# Altium schematic sheet Wheel.SchDoc
size A4
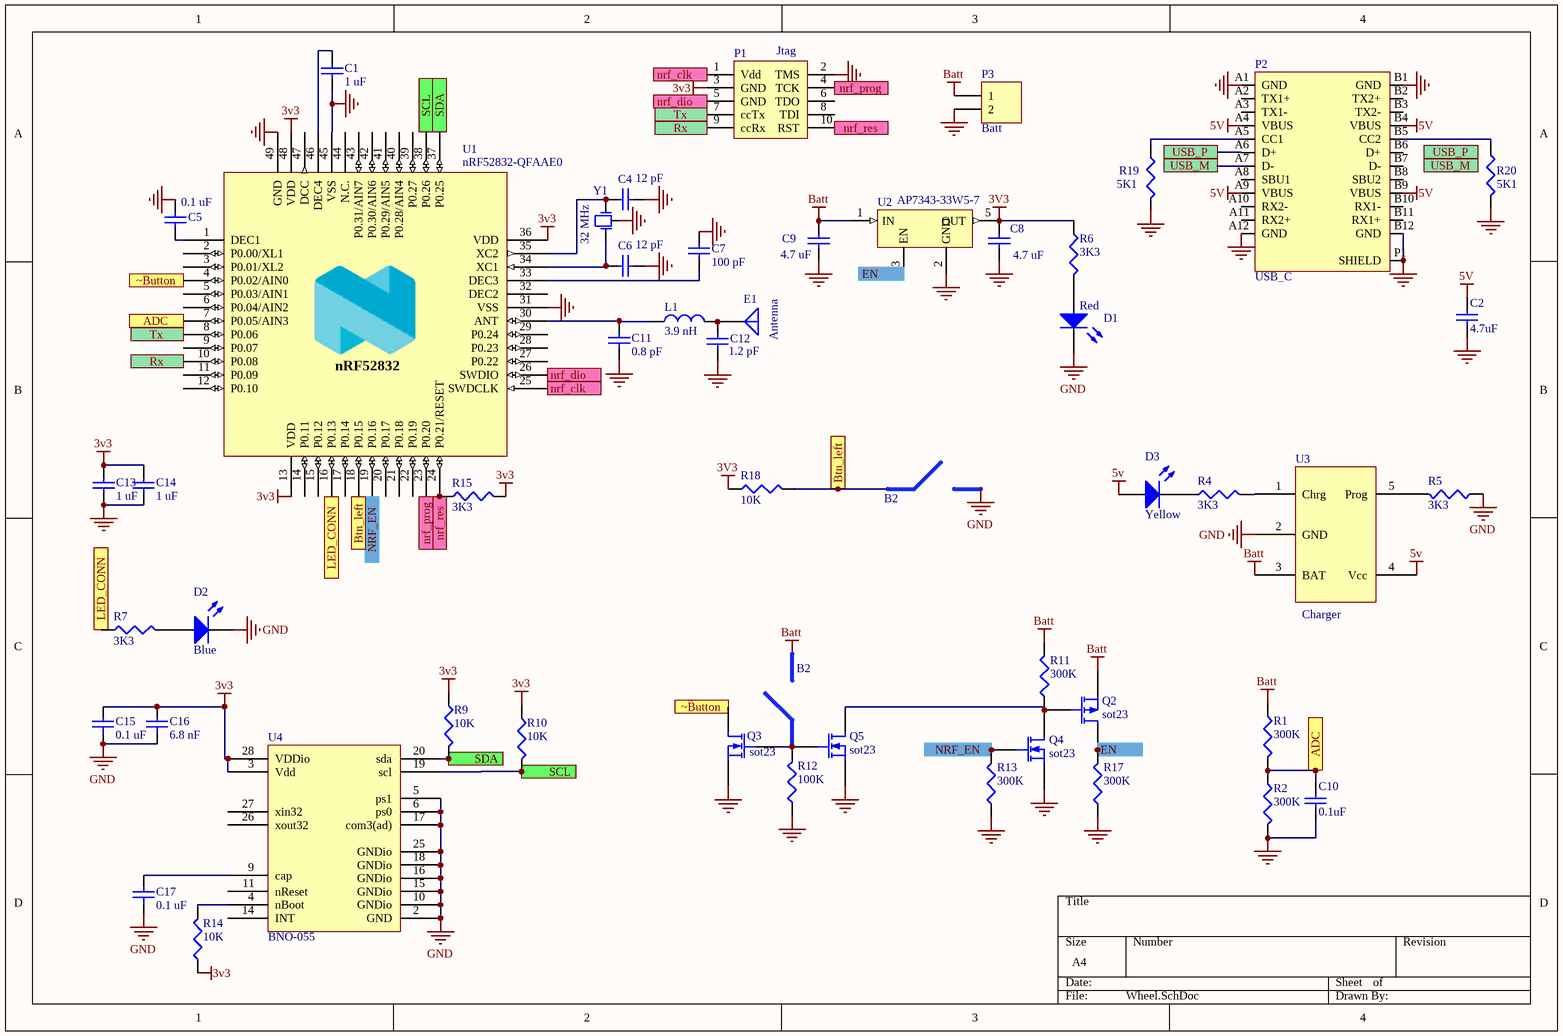
[diagram p0: Wheel.SchDoc]

## Parts
(Parts that share a designator on the sheet are numbered #1, #2 ... from top to bottom, then left to right.)
B2#1  LEFT  [Button_thin]  (value not drawn)
B2#2  RIGHT  [Button_thin]  (value not drawn)
C1  value 1 uF  [cap_0603]  (hidden comment: ceram)
C2  value 4.7uF  [cap_0603]  (hidden comment: ceram)
C4  value 12 pF  [cap_0603]  (hidden comment: ceram)
C5  value 0.1 uF  [cap_0603]  (hidden comment: ceram)
C6  value 12 pF  [cap_0603]  (hidden comment: ceram)
C7  value 100 pF  [cap_0603]  (hidden comment: ceram)
C8  value 4.7 uF  [cap_0603]  (hidden comment: ceram)
C9  value 4.7 uF  [cap_0603]  (hidden comment: ceram)
C10  value 0.1uF  [cap_0603]  (hidden comment: ceram)
C11  value 0.8 pF  [cap_0603]  (hidden comment: ceram)
C12  value 1.2 pF  [cap_0603]  (hidden comment: ceram)
C13  value 1 uF  [cap_0603]  (hidden comment: ceram)
C14  value 1 uF  [cap_0603]  (hidden comment: ceram)
C15  value 0.1 uF  [cap_0603]  (hidden comment: ceram)
C16  value 6.8 nF  [cap_0603]  (hidden comment: ceram)
C17  value 0.1 uF  [cap_0603]  (hidden comment: ceram)
D1  value Red  [led_0603]  (hidden comment: led_0603)
D2  Blue  [led_0603]
D3  Yellow  [led_0603]
E1  Antenna  [WBx5_ANT]
L1  value 3.9 nH  [IND SMD 0603]  (hidden comment: Ind)
P1  Jtag  [FTSH-105-01-F-DV-K]
P2  USB_C  [USB_C_FULL]
P3  Batt  [HDR1X2]
Q2  sot23  [sot23]
Q3  sot23  [sot23]
Q4  sot23  [sot23]
Q5  sot23  [sot23]
R1  value 300K  [res_0603]  (hidden comment: Res3)
R2  value 300K  [res_0603]  (hidden comment: Res3)
R4  value 3K3  [res_0603]  (hidden comment: res_0603)
R5  value 3K3  [res_0603]  (hidden comment: res_0603)
R6  value 3K3  [res_0603]  (hidden comment: res_0603)
R7  value 3K3  [res_0603]  (hidden comment: res_0603)
R9  value 10K  [res_0603]  (hidden comment: res_0603)
R10  value 10K  [res_0603]  (hidden comment: res_0603)
R11  value 300K  [res_0603]  (hidden comment: Res3)
R12  value 100K  [res_0603]  (hidden comment: Res3)
R13  value 300K  [res_0603]  (hidden comment: Res3)
R14  value 10K  [res_0603]  (hidden comment: res_0603)
R15  value 3K3  [res_0603]  (hidden comment: res_0603)
R17  value 300K  [res_0603]  (hidden comment: Res3)
R18  value 10K  [res_0603]  (hidden comment: res_0603)
R19  value 5K1  [res_0603]  (hidden comment: res_0603)
R20  value 5K1  [res_0603]  (hidden comment: res_0603)
U1  nRF52832-QFAAE0  [QFN48N]
U2  AP7343-33W5-7  [sot23-5]
U3  Charger  [sot23-5]
U4  BNO-055  [LGA-28]
Y1  value 32 MHz  [TSX-3225]  (hidden comment: Crystal Oscillator)

## Ports
ADC, Btn_left, EN, LED_CONN, nrf_clk, nrf_dio, NRF_EN, nrf_prog, nrf_res, Rx, SCL, SDA, Tx, USB_M, USB_P, ~Button

## Nets
3v3: C8.2 C13.2 C14.2 C15.2 C16.2 P1.3(GND) R6.1 R9.1 R10.1 R14.1 R15.2 R18.1 U1.13(VDD) U1.36(VDD) U1.48(VDD) U2.5(OUT) U4.3(Vdd) U4.28(VDDio)
5V: C2.1 D3.2(A) P2.A4(VBUS) P2.A9(VBUS) P2.B4(VBUS) P2.B9(VBUS) U3.4(Vcc)
Batt: B2#2.2 C9.2 P3.1 Q2.2(S) R1.1 R11.1 U2.1(IN) U3.3(BAT)
GND: B2#1.2 C1.1 C2.2 C4.2 C5.2 C6.2 C7.1 C8.1 C9.1 C10.2 C11.2 C12.2 C13.1 C14.1 C15.1 C16.1 C17.1 D1.1(K) D2.1(K) P1.2(TMS) P2.A1(GND) P2.A12(GND) P2.B1(GND) P2.B12(GND) P2.P1(SHIELD) P3.2 Q3.2(S) Q4.2(S) Q5.2(S) R2.2 R5.1 R12.1 R13.2 R17.2 R19.2 R20.2 U1.31(VSS) U1.45(VSS) U1.49(GND) U2.2(GND) U3.2(GND) U4.2(GND) U4.5(ps1) U4.6(ps0) U4.10(GNDio) U4.15(GNDio) U4.16(GNDio) U4.17(com3(ad)) U4.18(GNDio) U4.25(GNDio) Y1.3(OSC1)
ADC: C10.1 R1.2 R2.1 U1.7(P0.05/AIN3) ; port ADC
Btn_left: B2#1.1 R18.2 U1.18(P0.15) ; port Btn_left
EN: Q2.3(D) R17.1 U2.3(EN) ; port EN
LED_CONN: R7.1 U1.16(P0.13) ; port LED_CONN
nrf_clk: P1.1(Vdd) U1.25(SWDCLK) ; port nrf_clk
nrf_dio: P1.5(GND) U1.26(SWDIO) ; port nrf_dio
NRF_EN: Q4.1(G) R13.1 U1.19(P0.16) ; port NRF_EN
nrf_prog: P1.4(TCK) U1.23(P0.20) ; port nrf_prog
nrf_res: P1.10(RST) R15.1 U1.24(P0.21/RESET) ; port nrf_res
Rx: P1.9(ccRx) U1.10(P0.08) ; port Rx
SCL: R10.2 U1.38(P0.26) U4.19(scl) ; port SCL
SDA: R9.2 U1.37(P0.25) U4.20(sda) ; port SDA
Tx: P1.7(ccTx) U1.8(P0.06) ; port Tx
USB_M: P2.A7(D-) ; port USB_M
USB_P: P2.A6(D+) ; port USB_P
~Button: Q3.3(D) U1.4(P0.02/AIN0) ; port ~Button
NetB2#2_1: B2#2.1 Q3.1(G) Q5.1(G) R12.2
NetC1_2: C1.2 U1.46(DEC4)
NetC4_1: C4.1 U1.35(XC2) Y1.2(OSC2)
NetC5_1: C5.1 U1.1(DEC1)
NetC6_1: C6.1 U1.34(XC1) Y1.1(OSC1)
NetC7_2: C7.2 U1.33(DEC3)
NetC11_1: C11.1 L1.1 U1.30(ANT)
NetC12_1: C12.1 E1.1(A) L1.2
NetC17_2: C17.2 U4.9(cap)
NetD1_2: D1.2(A) R6.2
NetD2_2: D2.2(A) R7.2
NetD3_1: D3.1(K) R4.1
NetP2_A5: P2.A5(CC1) R19.1
NetP2_B5: P2.B5(CC2) R20.1
NetQ2_1: Q2.1(G) Q4.3(D) Q5.3(D) R11.2
NetR4_2: R4.2 U3.1(Chrg)
NetR5_2: R5.2 U3.5(Prog)
NetR14_2: R14.2 U4.4(nBoot)

Not connected (* = marked no-connect by the designer): P1 6(TDO) 8(TDI); P2 A2(TX1+) A3(TX1-) A8(SBU1) A10(RX2-) A11(RX2+) B2(TX2+) B3(TX2-) B6(D+) B7(D-) B8(SBU2) B10(RX1-) B11(RX1+); U1 2(P0.00/XL1) 3(P0.01/XL2) 5(P0.03/AIN1) 6(P0.04/AIN2) 9(P0.07) 11(P0.09) 12(P0.10) 14(P0.11) 15(P0.12) 17(P0.14) 20(P0.17) 21(P0.18) 22(P0.19) 27(P0.22) 28(P0.23) 29(P0.24) 32(DEC2) 39(P0.27) 40(P0.28/AIN4) 41(P0.29/AIN5) 42(P0.30/AIN6) 43(P0.31/AIN7) 44(N.C.) 47(DCC); U4 11(nReset) 14(INT) 26(xout32) 27(xin32)

## Notes on the sheet
- (in symbol nRF52832_QFAA) nRF52832

## Library data of the parts
B2#1 B2#2 = tact button: FSM6JH
C1 C2 C4-C17 = cap_0603
D1-D3 = led_0603: led
E1 = Antenna: Generic Antenna; Published: 24-Mar-1999; LatestRevisionDate: 17-Jul-2002; LatestRevisionNote: Re-released for DXP Platform.; PackageReference: PIN1; Publisher: Altium Limited
L1 = Ind. SMD: Inductance
P1 = cc1310 jtag header: FTSH-105-01-F-DV-K; Part: FTSH-105-01-F-DV-K; Part2: PLLD1.27-10S
P2 = USB_C_FULL: Part: 1054500101
P3 = Header 2: Header, 2-Pin; LatestRevisionDate: 17-Jul-2002; LatestRevisionNote: Re-released for DXP Platform.; Publisher: Altium Limited
Q2 = P_ch sot23: Part: IRLML2244TRPBF
Q3-Q5 = N_ch sot23: Part: IRLML2402TRPBF
R1 R2 R11-R13 R17 = Res3: Resistor; Published: 8-Jun-2000; LatestRevisionDate: 29-May-2009; LatestRevisionNote: IPC-7351 Footprint Added.; PackageReference: J1-0603; Publisher: Altium Limited; PackageDescription: Chip Resistor
R4-R7 R9 R10 R14 R15 R18-R20 = res_0603: resistor
U1 = nRF52832_QFAA: Multi-protocol Bluetooth Low Energy, ANT and 2.4GHz proprietary system-on-chip; Manufacturer: Nordic Semiconductor; Artikkelnr Noca: N.A.; Part: nRF52832-QFAAE0; Manufacturer Part Number: nRF52832-QFAAE0; LatestRevisionDate: 2017-10-18; Pin Count: 48; Publisher: Nordic Semiconductor; Published: 2017-10-18; Value: nRF52832-QFAAE0; Note: *; Footprint Doc: QFN-48; Part number IPS: N.A.; ComponentLink1URL: *; ComponentLink1Description: Datasheet; ComponentLink2URL: *; ComponentLink2Description: Supplier link; HelpURL: *; Supplier 1: Nordic Semiconductor; Supplier Part Number 1: nRF52832-QFAAE0; Supplier 2: *; Supplier Part Number 2: *
U2 = LDO reg: Part: AP7343-33W5-7
U3 = LTC4054ES5: Li-ion Charge Controller; Part: LTC4054ES5
U4 = BNO-055: IMU; Part: BNO-055
Y1 = OSC_3pin: Part: TSX-322532.0000MF10Z-W6